# Altium schematic sheet 8_PP1_PHY_CPU_88E1116.SchDoc
size 419 x 296 mm; Author: Serbinov O.A.; CompanyName: ELSICOM; DrawnBy: Serbinov O.A.; Engineer: Serbinov O.A.; Organization: Elsicom; Address1: Kirova avenue, 58; Address2: Tomsk; Address3: Russia 634012; DocumentNumber: 9; SheetNumber: 9; SheetTotal: 44; ProjectName: 48_PORTS
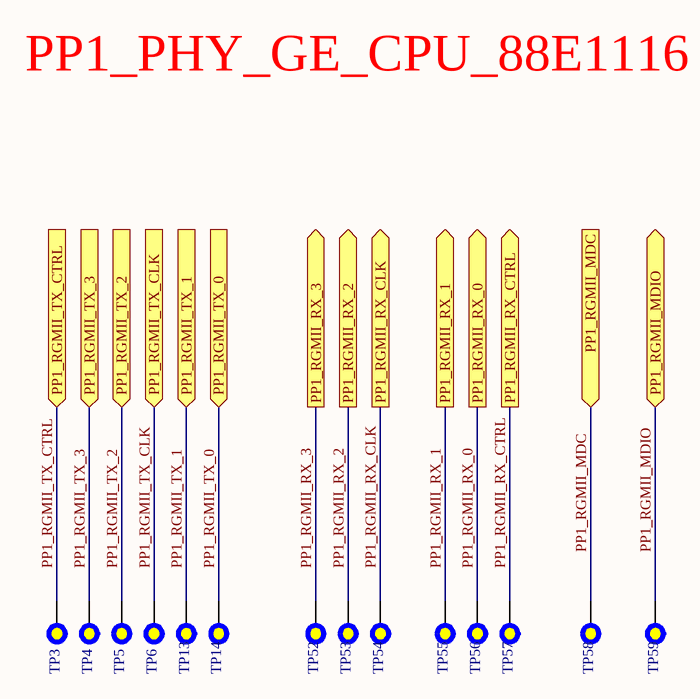
[diagram p0: 8_PP1_PHY_CPU_88E1116.SchDoc]

## Parts
TP3  Test Point 0.5mm pad  [Test Point 0.5mm]  (value not drawn)  (no BOM)
TP4  Test Point 0.5mm pad  [Test Point 0.5mm]  (value not drawn)  (no BOM)
TP5  Test Point 0.5mm pad  [Test Point 0.5mm]  (value not drawn)  (no BOM)
TP6  Test Point 0.5mm pad  [Test Point 0.5mm]  (value not drawn)  (no BOM)
TP13  Test Point 0.5mm pad  [Test Point 0.5mm]  (value not drawn)  (no BOM)
TP14  Test Point 0.5mm pad  [Test Point 0.5mm]  (value not drawn)  (no BOM)
TP52  Test Point 0.5mm pad  [Test Point 0.5mm]  (value not drawn)  (no BOM)
TP53  Test Point 0.5mm pad  [Test Point 0.5mm]  (value not drawn)  (no BOM)
TP54  Test Point 0.5mm pad  [Test Point 0.5mm]  (value not drawn)  (no BOM)
TP55  Test Point 0.5mm pad  [Test Point 0.5mm]  (value not drawn)  (no BOM)
TP56  Test Point 0.5mm pad  [Test Point 0.5mm]  (value not drawn)  (no BOM)
TP57  Test Point 0.5mm pad  [Test Point 0.5mm]  (value not drawn)  (no BOM)
TP58  Test Point 0.5mm pad  [Test Point 0.5mm]  (value not drawn)  (no BOM)
TP59  Test Point 0.5mm pad  [Test Point 0.5mm]  (value not drawn)  (no BOM)

## Ports
PP1_RGMII_MDC (in), PP1_RGMII_MDIO (bidir), PP1_RGMII_RX_0 (out), PP1_RGMII_RX_1 (out), PP1_RGMII_RX_2 (out), PP1_RGMII_RX_3 (out), PP1_RGMII_RX_CLK (out), PP1_RGMII_RX_CTRL (out), PP1_RGMII_TX_0 (in), PP1_RGMII_TX_1 (in), PP1_RGMII_TX_2 (in), PP1_RGMII_TX_3 (in), PP1_RGMII_TX_CLK (in), PP1_RGMII_TX_CTRL (in)

## Nets
PP1_RGMII_MDC: TP58.1 ; port PP1_RGMII_MDC
PP1_RGMII_MDIO: TP59.1 ; port PP1_RGMII_MDIO
PP1_RGMII_RX_0: TP56.1 ; port PP1_RGMII_RX_0
PP1_RGMII_RX_1: TP55.1 ; port PP1_RGMII_RX_1
PP1_RGMII_RX_2: TP53.1 ; port PP1_RGMII_RX_2
PP1_RGMII_RX_3: TP52.1 ; port PP1_RGMII_RX_3
PP1_RGMII_RX_CLK: TP54.1 ; port PP1_RGMII_RX_CLK
PP1_RGMII_RX_CTRL: TP57.1 ; port PP1_RGMII_RX_CTRL
PP1_RGMII_TX_0: TP14.1 ; port PP1_RGMII_TX_0
PP1_RGMII_TX_1: TP13.1 ; port PP1_RGMII_TX_1
PP1_RGMII_TX_2: TP5.1 ; port PP1_RGMII_TX_2
PP1_RGMII_TX_3: TP4.1 ; port PP1_RGMII_TX_3
PP1_RGMII_TX_CLK: TP6.1 ; port PP1_RGMII_TX_CLK
PP1_RGMII_TX_CTRL: TP3.1 ; port PP1_RGMII_TX_CTRL

## Notes on the sheet
- PP1_PHY_GE_CPU_88E1116
- A3
- SIZE
- PROJECT
- SHEET
- OF
- Engineer: Oleg Serbinov